# Altium project HV_Module_6W.PrjPCB (part 1 of 3)
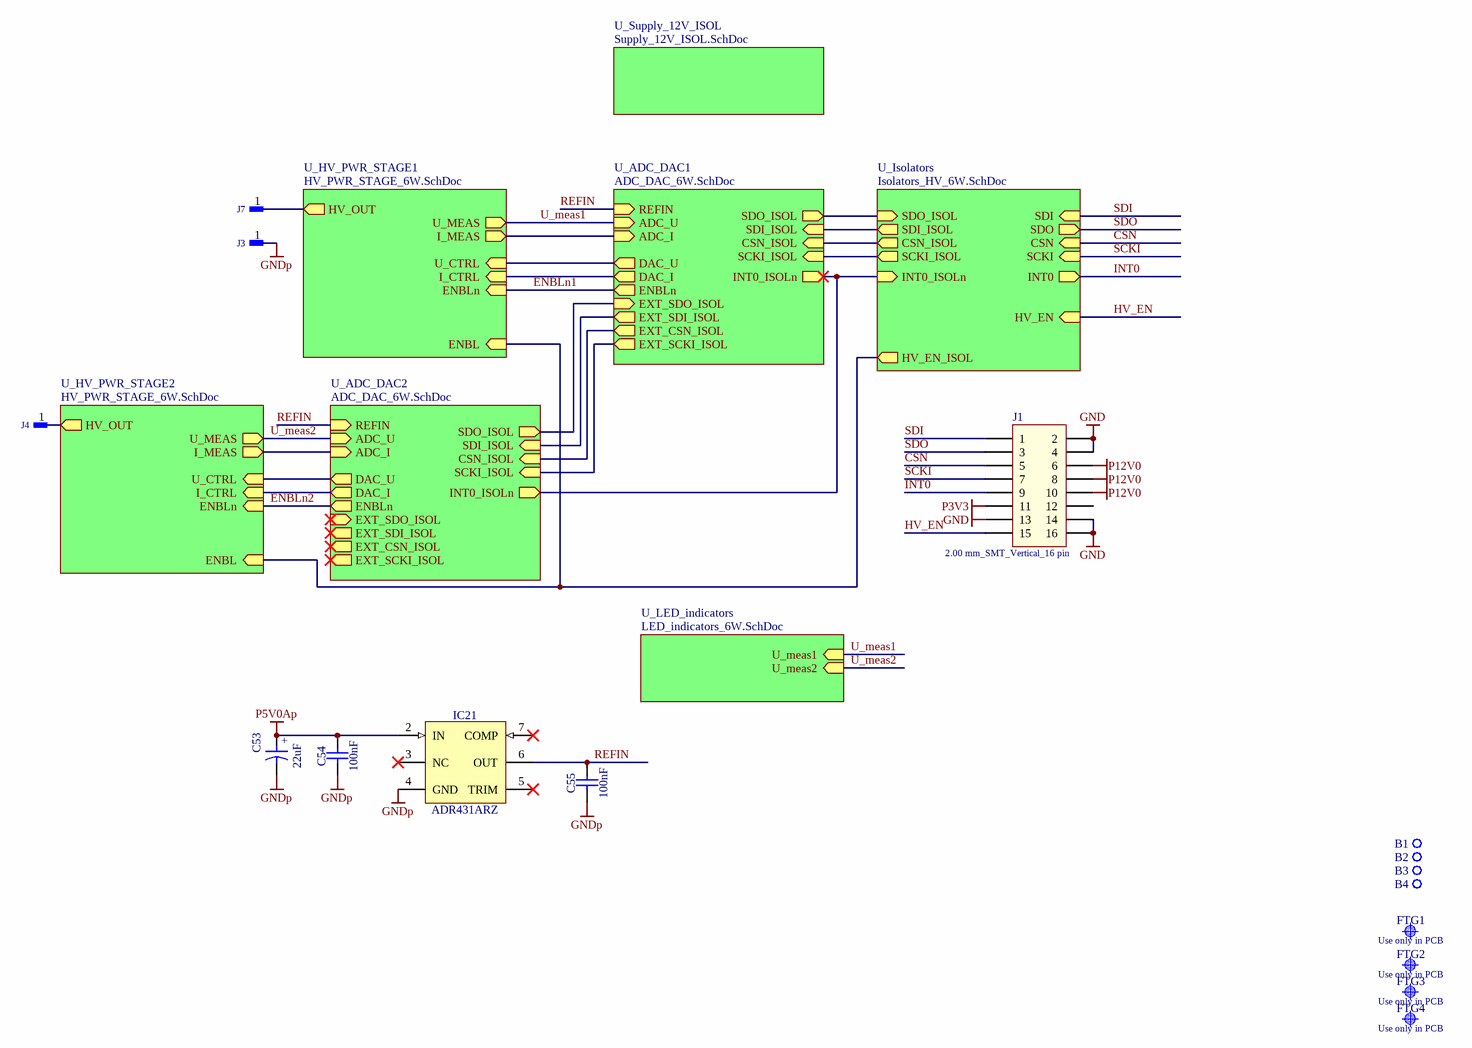
[diagram p0: HV_Module_6W.schdoc]
6 sheets, 457 parts. Net scope: hierarchical (ports join the sheet entries above them; power ports are global).
Board file: HV_Module_6W.PCBDOC
Sheets:
  HV_Module_6W.schdoc
    U_Isolators = Isolators_HV_6W.SchDoc
    U_ADC_DAC1 = ADC_DAC_6W.SchDoc
    U_HV_PWR_STAGE1 = HV_PWR_STAGE_6W.SchDoc
    U_Supply_12V_ISOL = Supply_12V_ISOL.SchDoc
    U_ADC_DAC2 = ADC_DAC_6W.SchDoc
    U_HV_PWR_STAGE2 = HV_PWR_STAGE_6W.SchDoc
    U_LED_indicators = LED_indicators_6W.SchDoc

## Sheet HV_Module_6W.schdoc: HV_Module v1.0
size 420 x 297 mm; EDA_Number: ARTIQ; Projet: HV_Module; Author: G.Kasprowicz; CompanyName: WUT ISE; DrawnBy: G.Kasprowicz; Organization: WUT ISE; Address1: PW ISE; Address2: Nowowiejska 15/19 00-665 Warsaw; Address3: gkasprow@gmail.com; DocumentNumber: 1; Revision: 1.0; SheetNumber: 1; SheetTotal: 6; ModifiedBy: -; CheckedDate: -; Title2: Top; DivGrp: WUT ISE; Designer: G.Kasprowicz; ModifiedDate: -; ProjectName: Sensor Box

### Parts
B1  Plated Hole  [MTG270_500]  (value not drawn)  (no BOM)
B2  Plated Hole  [MTG270_500]  (value not drawn)  (no BOM)
B3  Plated Hole  [MTG270_500]  (value not drawn)  (no BOM)
B4  Plated Hole  [MTG270_500]  (value not drawn)  (no BOM)
C53  22uF  [CAPMP3528X210N]
C54  100nF  [CAPC1005X55N]
C55  100nF  [CAPC1005X55N]
FTG1  Use only in PCB  [FIDUCIAL_TOP_C100-200]  (no BOM)
FTG2  Use only in PCB  [FIDUCIAL_TOP_S100-200]  (no BOM)
FTG3  Use only in PCB  [FIDUCIAL_TOP_S100-200]  (no BOM)
FTG4  Use only in PCB  [FIDUCIAL_TOP_S100-200]  (no BOM)
IC21  ADR431ARZ  [SOIC127P600X175-8N]
J1  2.00 mm_SMT_Vertical_16 pin  [62131621821]
J3  SMD Pad  [R400X300]  (value not drawn)
J4  SMD Pad  [R400X300]  (value not drawn)
J7  SMD Pad  [R400X300]  (value not drawn)

### Sub-sheets
U_ADC_DAC1 = ADC_DAC_6W.SchDoc: SDO_ISOL (out), SDI_ISOL (in), CSN_ISOL (in), SCKI_ISOL (in), INT0_ISOLn (out), ADC_U (in), ADC_I (in), DAC_U (out), DAC_I (out), EXT_SDO_ISOL (in), EXT_SDI_ISOL (out), EXT_CSN_ISOL (out), REFIN (in), EXT_SCKI_ISOL (out), ENBLn (out)
U_ADC_DAC2 = ADC_DAC_6W.SchDoc: SDO_ISOL (out), SDI_ISOL (in), CSN_ISOL (in), SCKI_ISOL (in), INT0_ISOLn (out), ADC_U (in), ADC_I (in), DAC_U (out), DAC_I (out), EXT_SDO_ISOL (in), EXT_SDI_ISOL (out), EXT_CSN_ISOL (out), REFIN (in), EXT_SCKI_ISOL (out), ENBLn (out)
U_HV_PWR_STAGE1 = HV_PWR_STAGE_6W.SchDoc: U_CTRL (in), I_MEAS (out), U_MEAS (out), HV_OUT (out), I_CTRL (in), ENBLn (in), ENBL (in)
U_HV_PWR_STAGE2 = HV_PWR_STAGE_6W.SchDoc: U_CTRL (in), I_MEAS (out), U_MEAS (out), HV_OUT (out), I_CTRL (in), ENBLn (in), ENBL (in)
U_Isolators = Isolators_HV_6W.SchDoc: SDI (in), SDO (out), CSN (in), SCKI (in), INT0 (out), HV_EN (in), SDI_ISOL (out), CSN_ISOL (out), HV_EN_ISOL (out), INT0_ISOLn (in), SCKI_ISOL (out), SDO_ISOL (in)
U_LED_indicators = LED_indicators_6W.SchDoc: U_meas1 (in), U_meas2 (in)
U_Supply_12V_ISOL = Supply_12V_ISOL.SchDoc: no entries

### Nets
GND: J1.2 J1.4 J1.13 J1.14 J1.16
GNDp: C53.2 C54.1 C55.1 IC21.4(GND) J3.1
P3V3: J1.11
P5V0Ap: C53.1 C54.2 IC21.2(IN)
P12V0: J1.6 J1.8 J1.10
ADC_I: sheet U_ADC_DAC1/ADC_I, sheet U_HV_PWR_STAGE1/I_MEAS
ADC_I: sheet U_ADC_DAC2/ADC_I, sheet U_HV_PWR_STAGE2/I_MEAS  [a separate net that carries the same name]
CSN: J1.5 ; sheet U_Isolators/CSN
CSN_ISOL: sheet U_Isolators/CSN_ISOL, sheet U_ADC_DAC1/CSN_ISOL
CSN_ISOL: sheet U_ADC_DAC1/EXT_CSN_ISOL, sheet U_ADC_DAC2/CSN_ISOL  [a separate net that carries the same name]
DAC_I: sheet U_ADC_DAC1/DAC_I, sheet U_HV_PWR_STAGE1/I_CTRL
DAC_I: sheet U_ADC_DAC2/DAC_I, sheet U_HV_PWR_STAGE2/I_CTRL  [a separate net that carries the same name]
DAC_U: sheet U_ADC_DAC1/DAC_U, sheet U_HV_PWR_STAGE1/U_CTRL
DAC_U: sheet U_ADC_DAC2/DAC_U, sheet U_HV_PWR_STAGE2/U_CTRL  [a separate net that carries the same name]
ENBL: sheet U_Isolators/HV_EN_ISOL, sheet U_HV_PWR_STAGE1/ENBL, sheet U_HV_PWR_STAGE2/ENBL
ENBLn1: sheet U_ADC_DAC1/ENBLn, sheet U_HV_PWR_STAGE1/ENBLn
ENBLn2: sheet U_ADC_DAC2/ENBLn, sheet U_HV_PWR_STAGE2/ENBLn
EXT_SCKI_ISOL: sheet U_ADC_DAC1/EXT_SCKI_ISOL, sheet U_ADC_DAC2/SCKI_ISOL
EXT_SDI_ISOL: sheet U_ADC_DAC1/EXT_SDI_ISOL, sheet U_ADC_DAC2/SDI_ISOL
EXT_SDO_ISOL: sheet U_ADC_DAC1/EXT_SDO_ISOL, sheet U_ADC_DAC2/SDO_ISOL
HV_EN: J1.15 ; sheet U_Isolators/HV_EN
HV_OUT: J7.1 ; sheet U_HV_PWR_STAGE1/HV_OUT
HV_OUT: J4.1 ; sheet U_HV_PWR_STAGE2/HV_OUT  [a separate net that carries the same name]
INT0: J1.9 ; sheet U_Isolators/INT0
INT0_ISOLn: sheet U_Isolators/INT0_ISOLn, sheet U_ADC_DAC1/INT0_ISOLn, sheet U_ADC_DAC2/INT0_ISOLn
REFIN: C55.2 IC21.6(OUT) ; sheet U_ADC_DAC1/REFIN, sheet U_ADC_DAC2/REFIN
SCKI: J1.7 ; sheet U_Isolators/SCKI
SCKI_ISOL: sheet U_Isolators/SCKI_ISOL, sheet U_ADC_DAC1/SCKI_ISOL
SDI: J1.1 ; sheet U_Isolators/SDI
SDI_ISOL: sheet U_Isolators/SDI_ISOL, sheet U_ADC_DAC1/SDI_ISOL
SDO: J1.3 ; sheet U_Isolators/SDO
SDO_ISOL: sheet U_Isolators/SDO_ISOL, sheet U_ADC_DAC1/SDO_ISOL
U_meas1: sheet U_ADC_DAC1/ADC_U, sheet U_HV_PWR_STAGE1/U_MEAS, sheet U_LED_indicators/U_meas1
U_meas2: sheet U_ADC_DAC2/ADC_U, sheet U_HV_PWR_STAGE2/U_MEAS, sheet U_LED_indicators/U_meas2

Not connected (* = marked no-connect by the designer): B1 1; B2 1; B3 1; B4 1; IC21 3(NC)* 5(TRIM)* 7(COMP)*; J1 12

### Notes on the sheet
- Project/Equipment
- Document
- Designer
- Drawn by
- Check.by
- Copyright WUT ISE 2020.
  This documentation describes Open Hardware and is licensed under the CERN OHL v.1.2. You may redistribute and modify this documentation under the terms of the CERN OHL v.1.2. (http://ohwr.org/CERNOHL). This documentation is distributed WITHOUT ANY EXPRESS OR IMPLIED WARRANTY, INCLUDING OF MERCHANTABILITY, SATISFACTORY QUALITY AND FITNESS FOR A PARTICULAR PURPOSE. Please see the CERN OHL v.1.2 for applicable conditions.
- Contact
- File
- Last Mod.
- Print Date
- Sheet
- Size
- A3
- of
- Rev
- (in symbol CTE3528-21_22UF_20V_10%) +

### Library data of the parts
B1-B4 = PLATED_HOLE2.7_PAD5.0: Single Terminal Socket; Part Description: Plated Through Hole: Hole Dia.=2.7mm Pad Dia.=5.0mm; Mounted: No; Part Number: PLATED_HOLE2.7_PAD5.0; Component Type: Standard (No BOM); Pin Count: 1; Family: Plated Hole; Socket: No; SMD: No; Sense: No; Status: None; ComponentHeight: 0mm; HelpURL: Undefined; Author: CERN DEM JMW; CreateDate: 27.09.2011; LatestRevisionDate: 27.09.2011; PackageDescription: Plated Through Hole: Hole Dia.=2.7mm Pad Dia.=5.0mm
C53 = CTE3528-21_22UF_20V_10%: Polarised capacitor; Part Description: Solid Tantalum Chip Capacitor; Manufacturer: GENERIC; Manufacturer1 Part Number: TAJB226K020R; Voltage: 20V; Tolerance: ±10%; Part Number: CTE3528-21_22UF_20V_10%; Component Kind: Standard; Component Type: Standard; Pin Count: 2; Value: 22uF; Status: Preferred; Manufacturer Part Number: CTE3528-21_22UF_20V_10%; Case: B; Mounted: Yes; Socket: No; SMD: Yes; Sense: No; Manufacturer1 Example: AVX; Manufacturer1 ComponentHeight: 2.1mm; HelpURL: \\cern.ch\dfs\Applications\Altium\Datasheets\CTE_AVX_TAJ.pdf; Author: CERN DEM JLC; CreateDate: 03/12/2007; LatestRevisionDate: 03/12/2007
C54 C55 = CC0402_100NF_16V_10%_X7R: Non-polarised capacitor; Part Description: SMD Multilayer Chip Ceramic Capacitor; Manufacturer: GENERIC; Manufacturer1 Part Number: GRM155R71C104KA88D; Voltage: 16V; TC: X7R; Tolerance: ±10%; Part Number: CC0402_100NF_16V_10%_X7R; Component Kind: Standard; Component Type: Standard; Pin Count: 2; Value: 100nF; Status: Not Recommended; Manufacturer Part Number: CC0402_100NF_16V_10%_X7R; Case: 0402; Mounted: Yes; Socket: No; SMD: Yes; Sense: No; Manufacturer1 Example: MURATA; Manufacturer1 ComponentHeight: 0.55mm; HelpURL: \\cern.ch\dfs\Applications\Altium\Datasheets\CC0402_X7R_MURATA_GRM.pdf; Author: CERN DEM JLC; CreateDate: 05.12.2013; LatestRevisionDate: 03.12.2007
FTG1 = FIDUCIAL_TARGET_C100-200: Fiducial Target; Part Description: Round Fiducial Target, Top Layer, 1.0mm, Top Solder 2.0mm, Keepout =2.0mm; Mounted: No; Part Number: FIDUCIAL_TARGET_C100-200; Component Type: Standard (No BOM); Pin Count: 1; Family: Fiducial; Socket: No; SMD: Yes; Sense: No; Status: None; ComponentHeight: 0mm; HelpURL: Undefined; Author: CERN DEM JLC; CreateDate: 09.02.2010; LatestRevisionDate: 04.04.2012; PackageDescription: Round Fiducial Target, Top Layer, 1.0mm, Top Solder 2.0mm, Keepout =2.0mm
FTG2-FTG4 = FIDUCIAL_TARGET_S100-200: Fiducial Target; Part Description: Square Fiducial Target, Top Layer, 1.0mm, Top Solder 2.0mm, Keepout =2.0mm; Mounted: No; Part Number: FIDUCIAL_TARGET_S100-200; Component Type: Standard (No BOM); Pin Count: 1; Family: Fiducial; Socket: No; SMD: Yes; Sense: No; Status: None; ComponentHeight: 0mm; HelpURL: Undefined; Author: CERN DEM JLC; CreateDate: 09.02.2010; LatestRevisionDate: 04.04.2012; PackageDescription: Square Fiducial Target, Top Layer, 1.0mm, Top Solder 2.0mm, Keepout =2.0mm
IC21 = ADR431ARZ: 2.5V ±0.12% 10ppm/°C Ultralow Noise XFET Voltage References with Current Sink and Source Capability; Part Description: 2.5V Output,  3mV ±0.12% Accuracy, 10ppm/°C Ultralow Noise XFET Voltage References with Current Sink and Source Capability; Manufacturer: ANALOG DEVICES; PressFit: No; Bonding: No; Part Number: ADR431ARZ; Component Kind: Standard; Component Type: Standard; Device: ADR431ARZ; PackageDescription: SOIC 8, Pitch 1.27mm, Body 4x5mm, IPC Medium Density; Manufacturer Part Number: ADR431ARZ; Pin Count: 6; Case: SOIC8; Mounted: Yes; Socket: No; SMD: Yes; Sense: No; ComponentHeight: 1.75mm; HelpURL: \\cern.ch\dfs\Applications\Altium\Datasheets\ADR431ARZ.pdf; Author: CERN DEM JLC; CreateDate: 26.08.2013; LatestRevisionDate: 26.08.2013
J1 = 62131621821: Socket Header WR-PHD, Pitch 2.00 mm, SMT, Vertical, dual row, 16 pin; Rated Current: 2 A; Pin Number: 16; Pitch: 2.00 mm; Working Voltage: 200 VAC; Contact Resistance: 20 mOhm; Insulation Resistance: >1000 MOhm; ComponentLink1Description: Manufacturer; ComponentLink1URL: http://www.we-online.de; ComponentLink2Description: Datasheet; ComponentLink2URL: http://katalog.we-online.com/em/datasheet/62131621821.pdf; Part Number: 62131621821; Published Date: Jan. 2018; Publisher: Wurth Elektronik; Operating Temperature: -40 to 105 degC; Mounting Technology: SMT; Row Number: dual; Orientation: Vertical
J3 J4 J7 = SMD_PAD_4X3MM: Single SMD Pad; Part Description: 4mm x 3mm SMD Pad; Mounted: No; Part Number: SMD_PAD_4X3MM; Component Kind: Standard (No BOM); Component Type: Standard (No BOM); Pin Count: 1; Family: SMD Pad; Socket: No; SMD: No; Sense: No; Status: None; ComponentHeight: 0mm; HelpURL: Undefined; Author: CERN DEM JLC; CreateDate: 15.03.2010; LatestRevisionDate: 15.03.2010; PackageDescription: 4mm x  3mm SMD Pad

## Sheet Isolators_HV_6W.SchDoc: HV_Module
size 420 x 297 mm; Author: G.Kasprowicz; CompanyName: WUT ISE; DrawnBy: G.Kasprowicz; Organization: WUT ISE; Address1: PW ISE; Address2: Nowowiejska 15/19 00-665 Warsaw; Address3: gkasprow@gmail.com; DocumentNumber: 4; Revision: 1.0; SheetNumber: 4; SheetTotal: 6; ModifiedBy: -; CheckedDate: -; Title2: Isolators; DivGrp: WUT ISE; Designer: G.Kasprowicz; ModifiedDate: -; ProjectName: Sensor Box
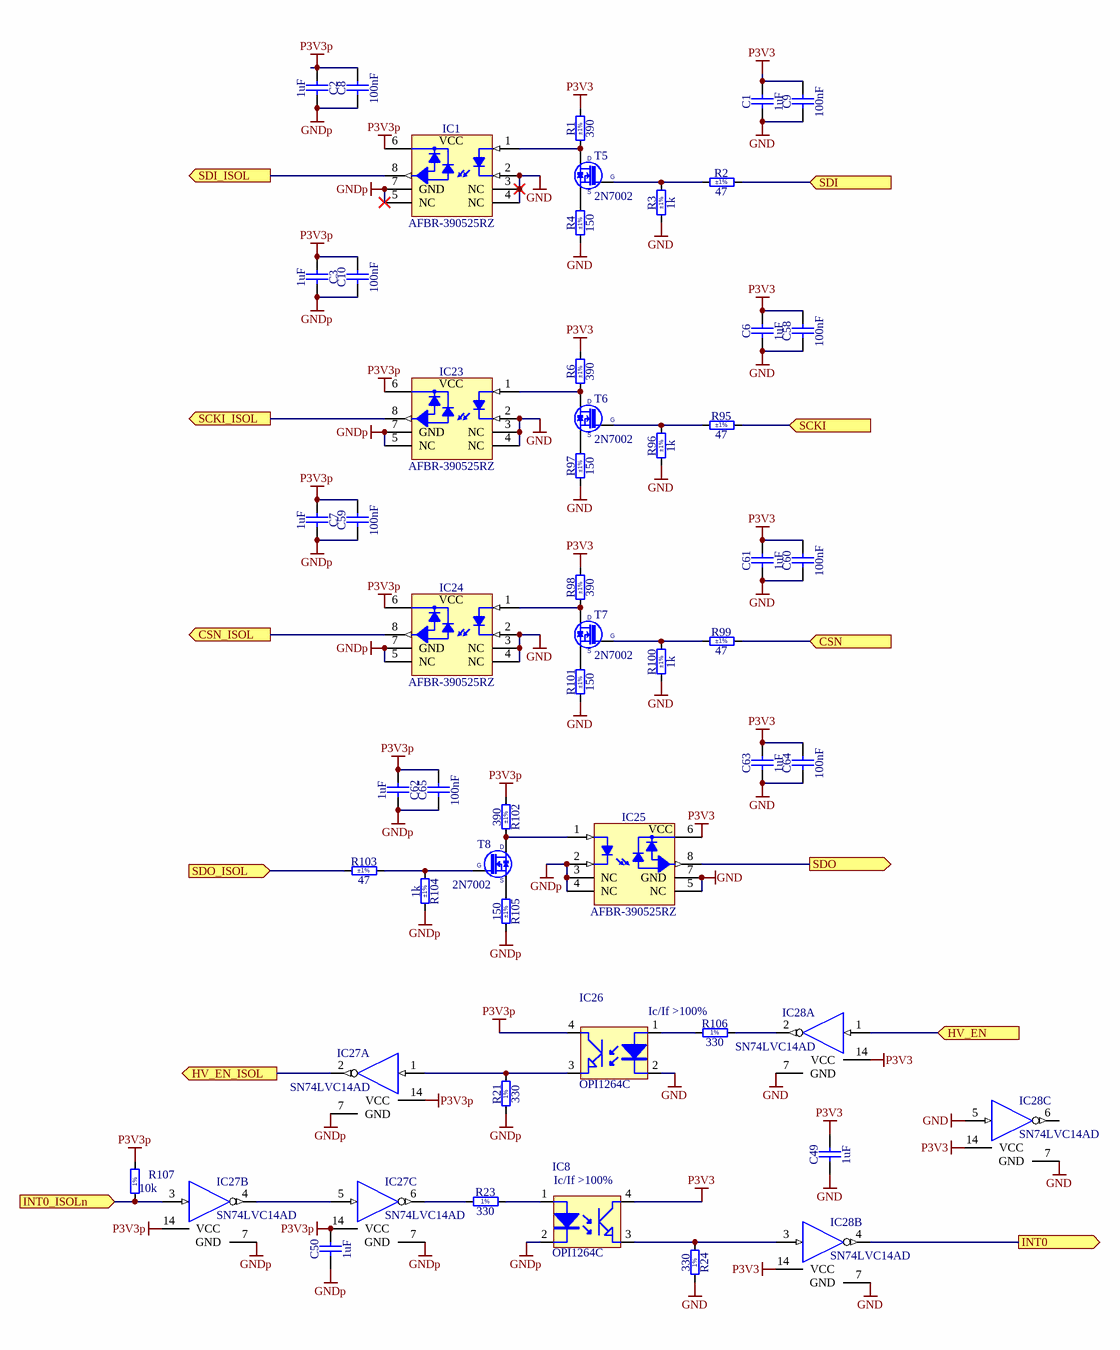
[diagram p1: Isolators_HV_6W.SchDoc]

### Parts
C1  1uF  [CAPC1005X55N]
C2  1uF  [CAPC1005X55N]
C3  1uF  [CAPC1005X55N]
C6  1uF  [CAPC1005X55N]
C7  1uF  [CAPC1005X55N]
C8  100nF  [CAPC1005X55N]
C9  100nF  [CAPC1005X55N]
C10  100nF  [CAPC1005X55N]
C49  1uF  [CAPC1005X55N]
C50  1uF  [CAPC1005X55N]
C58  100nF  [CAPC1005X55N]
C59  100nF  [CAPC1005X55N]
C60  100nF  [CAPC1005X55N]
C61  1uF  [CAPC1005X55N]
C62  1uF  [CAPC1005X55N]
C63  1uF  [CAPC1005X55N]
C64  100nF  [CAPC1005X55N]
C65  100nF  [CAPC1005X55N]
IC1  AFBR-390525RZ  [BROADCOM_AFBR-390525RZ]
IC8  OPI1264C  [OPI1264C]
IC23  AFBR-390525RZ  [BROADCOM_AFBR-390525RZ]
IC24  AFBR-390525RZ  [BROADCOM_AFBR-390525RZ]
IC25  AFBR-390525RZ  [BROADCOM_AFBR-390525RZ]
IC26  OPI1264C  [OPI1264C]
IC27  SN74LVC14AD  [SOIC127P600X175-14N]  (parts A,B,C of 6)
IC28  SN74LVC14AD  [SOIC127P600X175-14N]  (parts A,B,C of 6)
R1  390  Tolerance: ±1%  [RESC1608X55N]
R2  47  Tolerance: ±1%  [RESC1005X40N]
R3  1k  Tolerance: ±1%  [RESC1005X40N]
R4  150  Tolerance: ±1%  [RESC1608X55N]
R6  390  Tolerance: ±1%  [RESC1608X55N]
R21  330  [RESC1005X40N]
R23  330  [RESC1005X40N]
R24  330  [RESC1005X40N]
R95  47  Tolerance: ±1%  [RESC1005X40N]
R96  1k  Tolerance: ±1%  [RESC1005X40N]
R97  150  Tolerance: ±1%  [RESC1608X55N]
R98  390  Tolerance: ±1%  [RESC1608X55N]
R99  47  Tolerance: ±1%  [RESC1005X40N]
R100  1k  Tolerance: ±1%  [RESC1005X40N]
R101  150  Tolerance: ±1%  [RESC1608X55N]
R102  390  Tolerance: ±1%  [RESC1608X55N]
R103  47  Tolerance: ±1%  [RESC1005X40N]
R104  1k  Tolerance: ±1%  [RESC1005X40N]
R105  150  Tolerance: ±1%  [RESC1608X55N]
R106  330  [RESC1005X40N]
R107  10k  [RESC1005X40N]
T5  2N7002  [SOT95P240X130-3N]
T6  2N7002  [SOT95P240X130-3N]
T7  2N7002  [SOT95P240X130-3N]
T8  2N7002  [SOT95P240X130-3N]

### Ports
CSN (in), CSN_ISOL (out), HV_EN (in), HV_EN_ISOL (out), INT0 (out), INT0_ISOLn (in), SCKI (in), SCKI_ISOL (out), SDI (in), SDI_ISOL (out), SDO (out), SDO_ISOL (in)

### Nets
GND: C1.1 C6.1 C9.1 C49.2 C58.1 C60.1 C61.1 C63.2 C64.1 IC1.2(C) IC1.3(NC) IC1.4(NC) IC23.2(C) IC23.3(NC) IC23.4(NC) IC24.2(C) IC24.3(NC) IC24.4(NC) IC25.5(NC) IC25.7(GND) IC26.2(K) IC28.5(IN) IC28.7(GND) R3.1 R4.1 R24.1 R96.1 R97.1 R100.1 R101.1
GNDp: C2.2 C3.2 C7.2 C8.1 C10.1 C50.2 C59.1 C62.1 C65.1 IC1.5(NC) IC1.7(GND) IC8.2(K) IC23.5(NC) IC23.7(GND) IC24.5(NC) IC24.7(GND) IC25.2(C) IC25.3(NC) IC25.4(NC) IC27.7(GND) R21.1 R104.1 R105.1
P3V3: C1.2 C6.2 C9.2 C49.1 C58.2 C60.2 C61.2 C63.1 C64.2 IC8.4(C) IC25.6(VCC) IC28.14(VCC) R1.2 R6.2 R98.2
P3V3p: C2.1 C3.1 C7.1 C8.2 C10.2 C50.1 C59.2 C62.2 C65.2 IC1.6(VCC) IC23.6(VCC) IC24.6(VCC) IC26.4(C) IC27.14(VCC) R102.2 R107.2
CSN: R99.2 ; port CSN
CSN_ISOL: IC24.8(DATA_OUT) ; port CSN_ISOL
ENBL: IC27.2(OUT) ; port HV_EN_ISOL
HV_EN: IC28.1(IN) ; port HV_EN
INT0: IC28.4(OUT) ; port INT0
INT0_ISOLn: IC27.3(IN) R107.1 ; port INT0_ISOLn
SCKI: R95.2 ; port SCKI
SCKI_ISOL: IC23.8(DATA_OUT) ; port SCKI_ISOL
SDI: R2.2 ; port SDI
SDI_ISOL: IC1.8(DATA_OUT) ; port SDI_ISOL
SDO: IC25.8(DATA_OUT) ; port SDO
SDO_ISOL: R103.2 ; port SDO_ISOL
NetIC1_1: IC1.1(A) R1.1 T5.3(D)
NetIC8_1: IC8.1(A) R23.1
NetIC8_3: IC8.3(E) IC28.3(IN) R24.2
NetIC23_1: IC23.1(A) R6.1 T6.3(D)
NetIC24_1: IC24.1(A) R98.1 T7.3(D)
NetIC25_1: IC25.1(A) R102.1 T8.3(D)
NetIC26_1: IC26.1(A) R106.1
NetIC26_3: IC26.3(E) IC27.1(IN) R21.2
NetIC27_4: IC27.4(OUT) IC27.5(IN)
NetIC27_6: IC27.6(OUT) R23.2
NetIC28_2: IC28.2(OUT) R106.2
NetR2_1: R2.1 R3.2 T5.1(G)
NetR4_2: R4.2 T5.2(S)
NetR95_1: R95.1 R96.2 T6.1(G)
NetR97_2: R97.2 T6.2(S)
NetR99_1: R99.1 R100.2 T7.1(G)
NetR101_2: R101.2 T7.2(S)
NetR103_1: R103.1 R104.2 T8.1(G)
NetR105_2: R105.2 T8.2(S)

Not connected (* = marked no-connect by the designer): IC28 6(OUT)

### Notes on the sheet
- Project/Equipment
- Document
- Designer
- Drawn by
- Check.by
- Copyright WUT ISE 2020.
  This documentation describes Open Hardware and is licensed under the CERN OHL v.1.2. You may redistribute and modify this documentation under the terms of the CERN OHL v.1.2. (http://ohwr.org/CERNOHL). This documentation is distributed WITHOUT ANY EXPRESS OR IMPLIED WARRANTY, INCLUDING OF MERCHANTABILITY, SATISFACTORY QUALITY AND FITNESS FOR A PARTICULAR PURPOSE. Please see the CERN OHL v.1.2 for applicable conditions.
- Contact
- File
- Last Mod.
- Print Date
- Sheet
- Size
- A3
- of
- Rev
- (in symbol OPTO-OPI1264C) Ic/If >100%
- (in symbol R0402_10K_1%_0.0625W_100PPM) 1%
- (in symbol R0402_330R_1%_0.0625W_100PPM) 1%

### Library data of the parts
C1-C3 C6 C7 C49 C50 C61-C63 = CC0402_1UF_16V_10%_X5R: Non-polarised capacitor; Part Description: SMD Multilayer Chip Ceramic Capacitor; Manufacturer: GENERIC; Manufacturer1 Part Number: C1005X5R1C105KT; Voltage: 16V; TC: X5R; Tolerance: ±10%; Part Number: CC0402_1UF_16V_10%_X5R; Component Kind: Standard; Component Type: Standard; Pin Count: 2; Value: 1uF; Status: Preferred; Manufacturer Part Number: CC0402_1UF_16V_10%_X5R; Case: 0402; Mounted: Yes; Socket: No; SMD: Yes; Sense: No; Manufacturer1 Example: TDK; Manufacturer1 ComponentHeight: 0.55mm; HelpURL: \\cern.ch\dfs\Applications\Altium\Datasheets\CC0402_X5R_TDK_C.pdf; Author: CERN DEM JLC; CreateDate: 2012-10-25; LatestRevisionDate: 2012-10-25
C8-C10 C58-C60 C64 C65 = CC0402_100NF_16V_10%_X5R: Non-polarised capacitor; Part Description: SMD Multilayer Chip Ceramic Capacitor; Manufacturer: GENERIC; Manufacturer1 Part Number: GRM155R61C104KA88D; Voltage: 16V; TC: X5R; Tolerance: ±10%; Part Number: CC0402_100NF_16V_10%_X5R; Component Kind: Standard; Component Type: Standard; Pin Count: 2; Value: 100nF; Status: None; Manufacturer Part Number: CC0402_100NF_16V_10%_X5R; Case: 0402; Mounted: Yes; Socket: No; SMD: Yes; Sense: No; Manufacturer1 Example: MURATA; Manufacturer1 ComponentHeight: 0.55mm; HelpURL: \\cern.ch\dfs\Applications\Altium\Datasheets\CC0402_X5R_MURATA_GRM.pdf; Author: CERN DEM JLC; CreateDate: 10.12.2013; LatestRevisionDate: 10.12.2013
IC1 IC23-IC25 = AFBR-390525RZ: High Voltage Galvanic Insulation Link for DC to 5MBaud; Part Description: High Voltage Galvanic Insulation Link for DC to 5MBaud, Length 25mm, 15kV Voltage Supperssion; Manufacturer: BROADCOM; PressFit: No; Bonding: No; Part Number: AFBR-390525RZ; Component Kind: Standard; Component Type: Standard; Device: AFBR-390525RZ; PackageDescription: BROADCOM AFBR-390525RZ Case, Body 30.46mm L X 10.16mm W X 6.7mm H; Manufacturer Part Number: AFBR-390525RZ; Pin Count: 8; Mounted: Yes; Socket: No; SMD: No; Sense: No; ComponentHeight: 6.7mm; HelpURL: \\cern.ch\dfs\Applications\Altium\Datasheets\AFBR-390525RZ.pdf; Author: CERN DEM HF; CreateDate: 10.02.2022; LatestRevisionDate: 10.02.2022
IC8 IC26 = OPTO-OPI1264C: 10kV opto-coupler; Supplier 1: Newark; Supplier Part Number 1: 08F2863
IC27 IC28 = SN74LVC14AD: Hex Schmitt-Trigger Inverter; Manufacturer: TEXAS INSTRUMENTS; PressFit: No; Bonding: No; Part Number: SN74LVC14AD; Component Kind: Standard; Component Type: Standard; Device: SN74LVC14AD; PackageDescription: SOIC 14, Pitch 1.27mm - Body 4x8.75mm, IPC Medium Density; Part Description: Hex Schmitt-Trigger Inverter; Manufacturer Part Number: SN74LVC14AD; Pin Count: 14; Case: SOIC14; Mounted: Yes; Socket: No; SMD: Yes; Sense: No; ComponentHeight: 1.75mm; Author: CERN DEM JMW; HelpURL: \\cern.ch\dfs\Applications\Altium\Datasheets\SN74LVC14AD.pdf; CreateDate: 29.09.2008; LatestRevisionDate: 29.09.2008
R1 R6 R98 R102 = R0603_390R_1%_0.1W_100PPM: Resistor - 1%; Part Description: General Purpose Thick Film Chip Resistor; Manufacturer: GENERIC; Manufacturer1 Part Number: NRC06F3900TRF; Power: 0.1W; TC: ±100ppm/°C; PressFit: No; Part Number: R0603_390R_1%_0.1W_100PPM; Component Kind: Standard; Component Type: Standard; Pin Count: 2; Value: 390; Status: Preferred; Manufacturer Part Number: R0603_390R_1%_0.1W_100PPM; Case: 0603; Mounted: Yes; Sense: No; Socket: No; SMD: Yes; Manufacturer1 Example: NIC COMPONENT; Manufacturer1 ComponentHeight: 0.55mm; HelpURL: \\cern.ch\dfs\Applications\Altium\Datasheets\R0603_NIC_NRC.pdf; Author: CERN DEM JLC; CreateDate: 03.12.2007; LatestRevisionDate: 13.03.2008
R2 R95 R99 R103 = R0402_47R_1%_0.0625W_100PPM: Resistor - 1%; Part Description: General Purpose Thick Film Chip Resistor; Manufacturer: GENERIC; Manufacturer1 Part Number: 232270674709L; TC: ±100ppm/°C; PressFit: No; Part Number: R0402_47R_1%_0.0625W_100PPM; Component Kind: Standard; Component Type: Standard; Pin Count: 2; Value: 47; Status: Not Recommended; Power: 0.0625W; Manufacturer Part Number: R0402_47R_1%_0.0625W_100PPM; Case: 0402; Mounted: Yes; Sense: No; Socket: No; SMD: Yes; Manufacturer1 Example: YAGEO PHYCOMP; Manufacturer1 ComponentHeight: 0.4mm; HelpURL: \\cern.ch\dfs\Applications\Altium\Datasheets\R0402_Phycomp_RC0402.pdf; Author: CERN DEM JLC; CreateDate: 03.12.2007; LatestRevisionDate: 17.10.2012
R3 R96 R100 R104 = R0402_1K_1%_0.0625W_100PPM: Resistor - 1%; Part Description: General Purpose Thick Film Chip Resistor; Manufacturer: GENERIC; Manufacturer1 Part Number: 232270671002L; TC: ±100ppm/°C; PressFit: No; Part Number: R0402_1K_1%_0.0625W_100PPM; Component Kind: Standard; Component Type: Standard; Pin Count: 2; Value: 1k; Status: Not Recommended; Power: 0.0625W; Manufacturer Part Number: R0402_1K_1%_0.0625W_100PPM; Case: 0402; Mounted: Yes; Sense: No; Socket: No; SMD: Yes; Manufacturer1 Example: YAGEO PHYCOMP; Manufacturer1 ComponentHeight: 0.4mm; HelpURL: \\cern.ch\dfs\Applications\Altium\Datasheets\R0402_Phycomp_RC0402.pdf; Author: CERN DEM JLC; CreateDate: 03.12.2007; LatestRevisionDate: 17.10.2012
R4 R97 R101 R105 = R0603_150R_1%_0.1W_100PPM: Resistor - 1%; Part Description: General Purpose Thick Film Chip Resistor; Manufacturer: GENERIC; Manufacturer1 Part Number: NRC06F1500TRF; Power: 0.1W; TC: ±100ppm/°C; PressFit: No; Part Number: R0603_150R_1%_0.1W_100PPM; Component Kind: Standard; Component Type: Standard; Pin Count: 2; Value: 150; Status: Preferred; Manufacturer Part Number: R0603_150R_1%_0.1W_100PPM; Case: 0603; Mounted: Yes; Sense: No; Socket: No; SMD: Yes; Manufacturer1 Example: NIC COMPONENT; Manufacturer1 ComponentHeight: 0.55mm; HelpURL: \\cern.ch\dfs\Applications\Altium\Datasheets\R0603_NIC_NRC.pdf; Author: CERN DEM JLC; CreateDate: 03.12.2007; LatestRevisionDate: 13.03.2008
R21 R23 R24 R106 = R0402_330R_1%_0.0625W_100PPM: Resistor - 1%; Part Description: General Purpose Thick Film Chip Resistor; Manufacturer: GENERIC; Manufacturer1 Part Number: 232270673301L; TC: ±100ppm/°C; Part Number: R0402_330R_1%_0.0625W_100PPM; Component Kind: Standard; Component Type: Standard; Pin Count: 2; Value: 330; Status: Not recommended; Power: 0.0625W; Tolerance: ±1%; Manufacturer Part Number: R0402_330R_1%_0.0625W_100PPM; Case: 0402; Mounted: Yes; Sense: No; Socket: No; SMD: Yes; Manufacturer1 Example: YAGEO PHYCOMP; Manufacturer1 ComponentHeight: 0.4mm; HelpURL: \\cern.ch\dfs\Applications\Altium\Datasheets\R0402_Phycomp_RC0402.pdf; Author: CERN DEM JLC; CreateDate: 2007-12-03; LatestRevisionDate: 2012-10-17
R107 = R0402_10K_1%_0.0625W_100PPM: Resistor - 1%; Part Description: General Purpose Thick Film Chip Resistor; Manufacturer: GENERIC; Manufacturer1 Part Number: 232270671003L; TC: ±100ppm/°C; Part Number: R0402_10K_1%_0.0625W_100PPM; Component Kind: Standard; Component Type: Standard; Pin Count: 2; Value: 10k; Status: Not recommended; Power: 0.0625W; Tolerance: ±1%; Manufacturer Part Number: R0402_10K_1%_0.0625W_100PPM; Case: 0402; Mounted: Yes; Sense: No; Socket: No; SMD: Yes; Manufacturer1 Example: YAGEO PHYCOMP; Manufacturer1 ComponentHeight: 0.4mm; HelpURL: \\cern.ch\dfs\Applications\Altium\Datasheets\R0402_Phycomp_RC0402.pdf; Author: CERN DEM JLC; CreateDate: 2007-12-03; LatestRevisionDate: 2012-10-17
T5-T8 = 2N7002: N-CHANNEL MOSFET WITH DIODE; Part Description: 60V, 280mA, N-Channel Enhancement Mode Field Effect Transistor (FET); Manufacturer: FAIRCHILD SEMICONDUCTOR; PressFit: No; Bonding: No; Part Number: 2N7002; Component Kind: Standard; Component Type: Standard; Device: 2N7002; PackageDescription: SOT23, 0.95mm Pitch; 3 Pin, 1.30mm W X 2.90mm L X 1.30mm H body, IPC Medium Density; Manufacturer Part Number: 2N7002; Pin Count: 3; Case: SOT23-3; Mounted: Yes; Socket: No; SMD: Yes; Sense: No; ComponentHeight: 1.3mm; HelpURL: \\cern.ch\dfs\Applications\Altium\Datasheets\2N7002.pdf; Author: CERN DEM JLC; CreateDate: 20.08.2008; LatestRevisionDate: 07.04.2009

## Sheet ADC_DAC_6W.SchDoc: HV_Module
size 420 x 297 mm; EDA_Number: ARTIQ; Projet: HV_Module; Author: G.Kasprowicz; CompanyName: WUT ISE; DrawnBy: G.Kasprowicz; Organization: WUT ISE; Address1: PW ISE; Address2: Nowowiejska 15/19 00-665 Warsaw; Address3: gkasprow@gmail.com; DocumentNumber: 2; Revision: 1.0; SheetNumber: 2; SheetTotal: 6; ModifiedBy: -; CheckedDate: -; Title2: ADC_DAC; DivGrp: WUT ISE; Designer: G.Kasprowicz; ModifiedDate: -; ProjectName: Sensor Box
Used 2 times, as channels U_ADC_DAC1, U_ADC_DAC2. Parts and nets are listed once, with the designators drawn on the sheet.
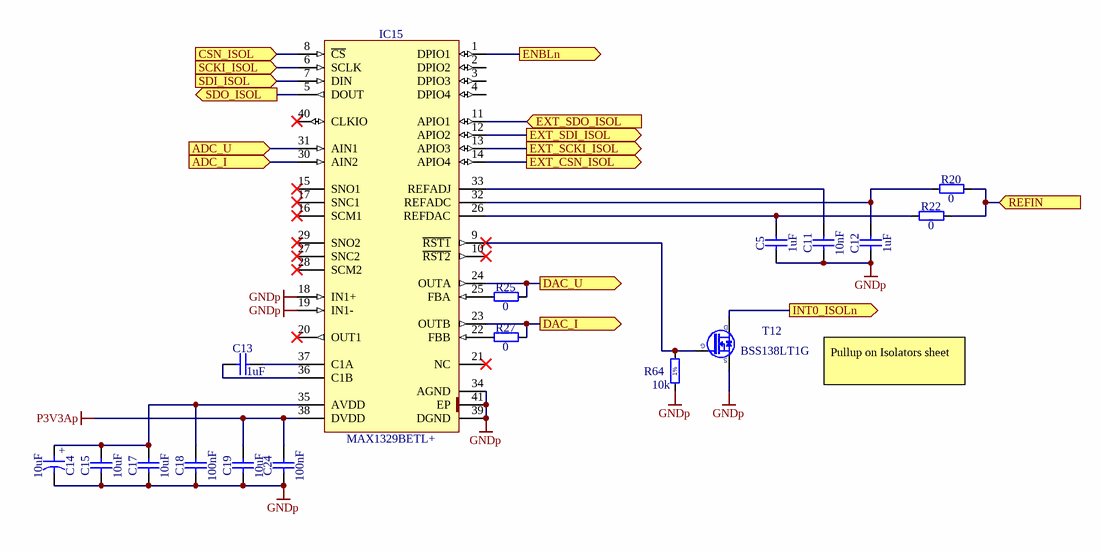
[diagram p2: ADC_DAC_6W.SchDoc]

### Parts
C5  1uF  [CAPC1005X55N]
C11  10nF  [CAPC1005X55N]
C12  1uF  [CAPC1005X55N]
C13  1uF  [CAPC1005X55N]
C14  10uF  [CAPMP3216X180N]
C15  10uF  [CAPC1608X80N]
C17  10uF  [CAPC1608X80N]
C18  100nF  [CAPC1005X55N]
C19  10uF  [CAPC1608X80N]
C24  100nF  [CAPC1005X55N]
IC15  MAX1329BETL+  [QFN50P600X600X80-41N-S425]
R20  0  [RESC1005X40N]
R22  0  [RESC1005X40N]
R25  0  [RESC1005X40N]
R27  0  [RESC1005X40N]
R64  10k  [RESC1005X40N]
T12  BSS138LT1G  [SOT95P240X110-3N]

### Ports
ADC_I (in), ADC_U (in), CSN_ISOL (in), DAC_I (out), DAC_U (out), ENBLn (out), EXT_CSN_ISOL (out), EXT_SCKI_ISOL (out), EXT_SDI_ISOL (out), EXT_SDO_ISOL (in), INT0_ISOLn (out), REFIN (in), SCKI_ISOL (in), SDI_ISOL (in), SDO_ISOL (out)

### Nets
GNDp: C5.1 C11.1 C12.1 C14.2 C15.1 C17.1 C18.1 C19.1 C24.1 IC15.18(IN1+) IC15.19(IN1-) IC15.34(AGND) IC15.39(DGND) IC15.41(EP) R64.1 T12.2(S)
P3V3Ap: C19.2 C24.2 IC15.38(DVDD)
ADC_I: IC15.30(AIN2) ; port ADC_I
ADC_U: IC15.31(AIN1) ; port ADC_U
CSN_ISOL: IC15.8(~{CS}) ; port CSN_ISOL
DAC_I: IC15.23(OUTB) R27.2 ; port DAC_I
DAC_U: IC15.24(OUTA) R25.2 ; port DAC_U
ENBLn: IC15.1(DPIO1) ; port ENBLn
EXT_CSN_ISOL: IC15.14(APIO4) ; port EXT_CSN_ISOL
EXT_SCKI_ISOL: IC15.13(APIO3) ; port EXT_SCKI_ISOL
EXT_SDI_ISOL: IC15.12(APIO2) ; port EXT_SDI_ISOL
EXT_SDO_ISOL: IC15.11(APIO1) ; port EXT_SDO_ISOL
INT0_ISOLn: T12.3(D) ; port INT0_ISOLn
REFIN: R20.2 R22.2 ; port REFIN
SCKI_ISOL: IC15.6(SCLK) ; port SCKI_ISOL
SDI_ISOL: IC15.7(DIN) ; port SDI_ISOL
SDO_ISOL: IC15.5(DOUT) ; port SDO_ISOL
NetC5_2: C5.2 IC15.26(REFDAC) R22.1
NetC11_2: C11.2 IC15.33(REFADJ)
NetC12_2: C12.2 IC15.32(REFADC) R20.1
NetC13_1: C13.1 IC15.36(C1B)
NetC13_2: C13.2 IC15.37(C1A)
NetC14_1: C14.1 C15.2 C17.2 C18.2 IC15.35(AVDD)
NetIC15_9: IC15.9(~{RST1}) R64.2 T12.1(G)
NetIC15_22: IC15.22(FBB) R27.1
NetIC15_25: IC15.25(FBA) R25.1

Not connected (* = marked no-connect by the designer): IC15 2(DPIO2) 3(DPIO3) 4(DPIO4) 10(~{RST2})* 15(SNO1)* 16(SCM1)* 17(SNC1)* 20(OUT1)* 21(NC)* 27(SNC2)* 28(SCM2)* 29(SNO2)* 40(CLKIO)*

### Channels
U_ADC_DAC1: designators end in A; ports ADC_I=ADC_I ADC_U=U_meas1 CSN_ISOL=CSN_ISOL DAC_I=DAC_I DAC_U=DAC_U ENBLn=ENBLn1 EXT_CSN_ISOL=CSN_ISOL EXT_SCKI_ISOL=EXT_SCKI_ISOL EXT_SDI_ISOL=EXT_SDI_ISOL EXT_SDO_ISOL=EXT_SDO_ISOL INT0_ISOLn=INT0_ISOLn REFIN=REFIN SCKI_ISOL=SCKI_ISOL SDI_ISOL=SDI_ISOL SDO_ISOL=SDO_ISOL
U_ADC_DAC2: designators end in B; ports ADC_I=ADC_I ADC_U=U_meas2 CSN_ISOL=CSN_ISOL DAC_I=DAC_I DAC_U=DAC_U ENBLn=ENBLn2 EXT_CSN_ISOL=EXT_CSN_ISOL_U_ADC_DAC2 EXT_SCKI_ISOL=EXT_SCKI_ISOL_U_ADC_DAC2 EXT_SDI_ISOL=EXT_SDI_ISOL_U_ADC_DAC2 EXT_SDO_ISOL=EXT_SDO_ISOL_U_ADC_DAC2 INT0_ISOLn=INT0_ISOLn REFIN=REFIN SCKI_ISOL=EXT_SCKI_ISOL SDI_ISOL=EXT_SDI_ISOL SDO_ISOL=EXT_SDO_ISOL

### Notes on the sheet
- Pullup on Isolators sheet
- Project/Equipment
- Document
- Designer
- Drawn by
- Check.by
- Copyright WUT ISE 2020.
  This documentation describes Open Hardware and is licensed under the CERN OHL v.1.2. You may redistribute and modify this documentation under the terms of the CERN OHL v.1.2. (http://ohwr.org/CERNOHL). This documentation is distributed WITHOUT ANY EXPRESS OR IMPLIED WARRANTY, INCLUDING OF MERCHANTABILITY, SATISFACTORY QUALITY AND FITNESS FOR A PARTICULAR PURPOSE. Please see the CERN OHL v.1.2 for applicable conditions.
- Contact
- File
- Last Mod.
- Print Date
- Sheet
- Size
- A3
- of
- Rev
- (in symbol CTE3216-18_10UF_16V_20%_AVX_TCJ) +
- (in symbol R0402_10K_1%_0.0625W_100PPM) 1%

### Library data of the parts
C5 C12 C13 = CC0402_1UF_16V_10%_X5R: as C1 on sheet Isolators_HV_6W; Part Number: CC0402_1UF_16V_10%_X5R; Component Kind: Standard; Component Type: Standard; Pin Count: 2; Value: 1uF; Status: Preferred; Manufacturer Part Number: CC0402_1UF_16V_10%_X5R; Case: 0402; Mounted: Yes; Socket: No; SMD: Yes; Sense: No; Manufacturer1 Example: TDK; Manufacturer1 ComponentHeight: 0.55mm; HelpURL: \\cern.ch\dfs\Applications\Altium\Datasheets\CC0402_X5R_TDK_C.pdf; Author: CERN DEM JLC; CreateDate: 2012-10-25; LatestRevisionDate: 2012-10-25
C11 = CC0402_10NF_25V_10%_X7R: Non-polarised capacitor; Part Description: SMD Multilayer Chip Ceramic Capacitor; Manufacturer: GENERIC; Manufacturer1 Part Number: C1005X7R1E103K050; Voltage: 25V; TC: X7R; Tolerance: ±10%; Part Number: CC0402_10NF_25V_10%_X7R; Component Kind: Standard; Component Type: Standard; Pin Count: 2; Value: 10nF; Status: Preferred; Manufacturer Part Number: CC0402_10NF_25V_10%_X7R; Case: 0402; Mounted: Yes; Socket: No; SMD: Yes; Sense: No; Manufacturer1 Example: TDK; Manufacturer1 ComponentHeight: 0.55mm; HelpURL: \\cern.ch\dfs\Applications\Altium\Datasheets\CC0402_X7R_TDK_C.pdf; Author: CERN DEM JLC; CreateDate: 25.10.2012; LatestRevisionDate: 25.10.2012
C14 = CTE3216-18_10UF_16V_20%_AVX_TCJ: Polarised capacitor; Part Description: ESR 0R200 Tantalum Solid Electrolytic Chip Capacitor with Conductive Polymer Electrode; Manufacturer: AVX; Manufacturer Part Number: TCJA106M016R0200; Voltage: 16V; Tolerance: ±20%; Part Number: CTE3216-18_10UF_16V_20%_AVX_TCJ; Component Kind: Standard; Component Type: Standard; Pin Count: 2; Value: 10uF; Status: Preferred; Case: A; Mounted: Yes; Socket: No; SMD: Yes; Sense: No; ComponentHeight: 1.8mm; HelpURL: \\cern.ch\dfs\Applications\Altium\Datasheets\CTE_AVX_TCJ.pdf; Author: CERN DEM JLC; CreateDate: 29.03.2012; LatestRevisionDate: 29.03.2012
C15 C17 C19 = CC0603_10UF_16V_20%_X5R: Non-polarised capacitor; Part Description: SMD Multilayer Chip Ceramic Capacitor; Manufacturer: GENERIC; Manufacturer1 Part Number: GRM188R61C106MA73D; Voltage: 16V; TC: X5R; Tolerance: ±20%; Part Number: CC0603_10UF_16V_20%_X5R; Component Kind: Standard; Component Type: Standard; Pin Count: 2; Value: 10uF; Status: None; Manufacturer Part Number: CC0603_10UF_16V_20%_X5R; Case: 0603; Mounted: Yes; Socket: No; SMD: Yes; Sense: No; Manufacturer1 Example: MURATA; Manufacturer1 ComponentHeight: 0.8mm; HelpURL: \\cern.ch\dfs\Applications\Altium\Datasheets\CC0603_X5R_MURATA_GRM.pdf; Author: CERN DEM MR; CreateDate: 02.03.2016; LatestRevisionDate: 02.03.2016
C18 C24 = CC0402_100NF_16V_10%_X5R: as C8 on sheet Isolators_HV_6W; Part Number: CC0402_100NF_16V_10%_X5R; Component Kind: Standard; Component Type: Standard; Pin Count: 2; Value: 100nF; Status: None; Manufacturer Part Number: CC0402_100NF_16V_10%_X5R; Case: 0402; Mounted: Yes; Socket: No; SMD: Yes; Sense: No; Manufacturer1 Example: MURATA; Manufacturer1 ComponentHeight: 0.55mm; HelpURL: \\cern.ch\dfs\Applications\Altium\Datasheets\CC0402_X5R_MURATA_GRM.pdf; Author: CERN DEM JLC; CreateDate: 10.12.2013; LatestRevisionDate: 10.12.2013
IC15 = MAX1329BETL+: 12-/16-Bit DAS with ADC, DACs, DPIOs, APIOs, Reference, Voltage Monitors, and Temp Sensor; Manufacturer: MAXIM; PressFit: No; Bonding: No; Part Number: MAX1329BETL+; Component Kind: Standard; Component Type: Standard; Device: MAX1329BETL+; PackageDescription: QFN, 0.50mm Pitch, Square; 40 Pin, 6.00mm L X 6.00mm W X 0.80mm H body (w/Thermal Tab 4.25 X 4.25mm), IPC Medium Density; Part Description: 12-/16-Bit DAS with ADC, DACs, DPIOs, APIOs, Reference, Voltage Monitors, and Temp Sensor; Manufacturer Part Number: MAX1329BETL+; Pin Count: 41; Case: QFN40; Mounted: Yes; Socket: No; SMD: Yes; Sense: No; ComponentHeight: 0.8mm; Author: CERN DEM HF; HelpURL: \\cern.ch\dfs\Applications\Altium\Datasheets\MAX1329BETL+.pdf; CreateDate: 09.02.2022; LatestRevisionDate: 09.02.2022
R20 R22 R25 R27 = R0402_0R_JUMPER: Resistor; Part Description: 1A (0.05R Max DC Resistance) Zero Ohm Jumper; Manufacturer: GENERIC; Manufacturer1 Part Number: 232270591001L; PressFit: No; Part Number: R0402_0R_JUMPER; Component Kind: Standard; Component Type: Standard; Pin Count: 2; Value: 0; Status: Not Recommended; Manufacturer Part Number: R0402_0R_JUMPER; Case: 0402; Mounted: Yes; Sense: No; Socket: No; SMD: Yes; Manufacturer1 Example: YAGEO PHYCOMP; Manufacturer1 ComponentHeight: 0.4mm; HelpURL: \\cern.ch\dfs\Applications\Altium\Datasheets\R0402_Phycomp_RC0402.pdf; Author: CERN DEM JLC; CreateDate: 03.12.2007; LatestRevisionDate: 17.10.2012
R64 = R0402_10K_1%_0.0625W_100PPM: as R107 on sheet Isolators_HV_6W; Part Number: R0402_10K_1%_0.0625W_100PPM; Component Kind: Standard; Component Type: Standard; Pin Count: 2; Value: 10k; Status: Not recommended; Power: 0.0625W; Tolerance: ±1%; Manufacturer Part Number: R0402_10K_1%_0.0625W_100PPM; Case: 0402; Mounted: Yes; Sense: No; Socket: No; SMD: Yes; Manufacturer1 Example: YAGEO PHYCOMP; Manufacturer1 ComponentHeight: 0.4mm; HelpURL: \\cern.ch\dfs\Applications\Altium\Datasheets\R0402_Phycomp_RC0402.pdf; Author: CERN DEM JLC; CreateDate: 2007-12-03; LatestRevisionDate: 2012-10-17
T12 = BSS138LT1G: N-CHANNEL MOSFET WITH DIODE; Part Description: 50V 200mA N-Channel Enhancement Mode Field-Effect Transistor; Manufacturer: ON SEMICONDUCTOR; PressFit: No; Bonding: No; Part Number: BSS138LT1G; Component Kind: Standard; Component Type: Standard; Device: BSS138LT1G; PackageDescription: SOT23 3-Leads, Pitch 0.95mm - Body 1.4x3mm, IPC Medium Density; Manufacturer Part Number: BSS138LT1G; Pin Count: 3; Case: SOT23-3; Mounted: Yes; Socket: No; SMD: Yes; Sense: No; ComponentHeight: 1.11mm; HelpURL: \\cern.ch\dfs\Applications\Altium\Datasheets\BSS138LT1G.pdf; Author: CERN DEM JLC; CreateDate: 23.03.2009; LatestRevisionDate: 23.03.2009